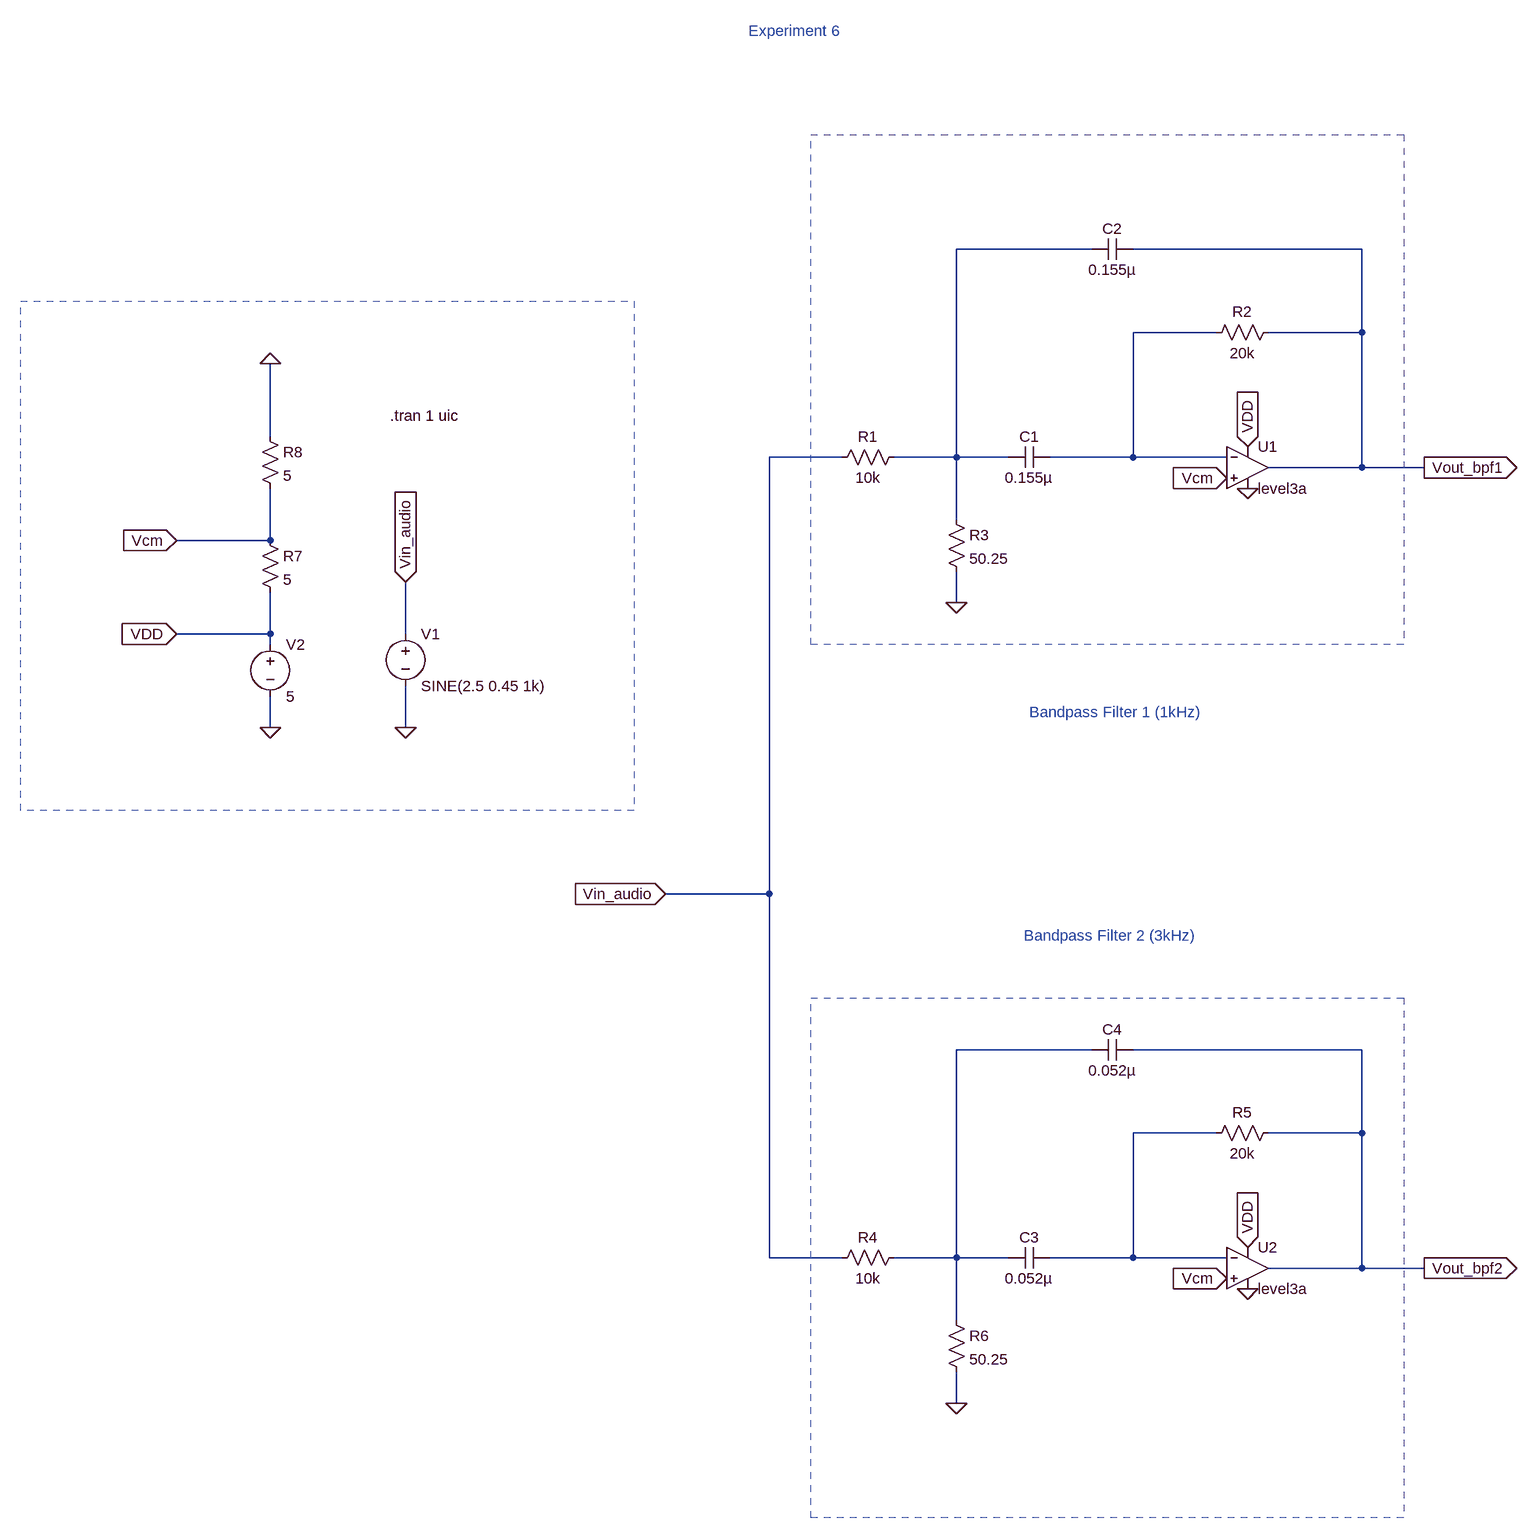
[diagram p0: schematic Ex 6.asc]
Ex 6.asc, the LTspice schematic file:
Version 4
SHEET 1 2004 1448
WIRE 720 -688 512 -688
WIRE 1136 -688 784 -688
WIRE 912 -560 784 -560
WIRE 1136 -560 1136 -688
WIRE 1136 -560 992 -560
WIRE -544 -400 -544 -512
WIRE 336 -368 224 -368
WIRE 512 -368 512 -688
WIRE 512 -368 416 -368
WIRE 592 -368 512 -368
WIRE 784 -368 784 -560
WIRE 784 -368 656 -368
WIRE 928 -368 784 -368
WIRE 1136 -352 1136 -560
WIRE 1136 -352 992 -352
WIRE 1232 -352 1136 -352
WIRE 512 -272 512 -368
WIRE -544 -240 -544 -320
WIRE -544 -240 -688 -240
WIRE 512 -144 512 -192
WIRE -544 -96 -544 -160
WIRE -544 -96 -688 -96
WIRE -336 -96 -336 -176
WIRE -544 -80 -544 -96
WIRE -544 48 -544 0
WIRE -336 48 -336 -16
WIRE 224 304 224 -368
WIRE 224 304 64 304
WIRE 720 544 512 544
WIRE 1136 544 784 544
WIRE 912 672 784 672
WIRE 1136 672 1136 544
WIRE 1136 672 992 672
WIRE 224 864 224 304
WIRE 336 864 224 864
WIRE 512 864 512 544
WIRE 512 864 416 864
WIRE 592 864 512 864
WIRE 784 864 784 672
WIRE 784 864 656 864
WIRE 928 864 784 864
WIRE 1136 880 1136 672
WIRE 1136 880 992 880
WIRE 1232 880 1136 880
WIRE 512 960 512 864
WIRE 512 1088 512 1040
FLAG 1232 -352 Vout_bpf1
IOPIN 1232 -352 Out
FLAG 512 -144 0
FLAG 1232 880 Vout_bpf2
IOPIN 1232 880 Out
FLAG 512 1088 0
FLAG 64 304 Vin_audio
IOPIN 64 304 In
FLAG -336 48 0
FLAG -336 -176 Vin_audio
IOPIN -336 -176 In
FLAG 960 -384 VDD
IOPIN 960 -384 In
FLAG 960 848 VDD
IOPIN 960 848 In
FLAG 960 -320 0
FLAG 960 912 0
FLAG 928 -336 Vcm
IOPIN 928 -336 In
FLAG 928 896 Vcm
IOPIN 928 896 In
FLAG -544 48 0
FLAG -544 -512 0
FLAG -688 -96 VDD
IOPIN -688 -96 In
FLAG -688 -240 Vcm
IOPIN -688 -240 In
SYMBOL res 432 -384 R90
WINDOW 0 0 56 VBottom 2
WINDOW 3 32 56 VTop 2
SYMATTR InstName R1
SYMATTR Value 10k
SYMBOL cap 656 -384 R90
WINDOW 0 0 32 VBottom 2
WINDOW 3 32 32 VTop 2
SYMATTR InstName C1
SYMATTR Value 0.155µ
SYMBOL res 1008 -576 R90
WINDOW 0 0 56 VBottom 2
WINDOW 3 32 56 VTop 2
SYMATTR InstName R2
SYMATTR Value 20k
SYMBOL res 496 -288 R0
SYMATTR InstName R3
SYMATTR Value 50.25
SYMBOL cap 784 -704 R90
WINDOW 0 0 32 VBottom 2
WINDOW 3 32 32 VTop 2
SYMATTR InstName C2
SYMATTR Value 0.155µ
SYMBOL res 432 848 R90
WINDOW 0 0 56 VBottom 2
WINDOW 3 32 56 VTop 2
SYMATTR InstName R4
SYMATTR Value 10k
SYMBOL cap 656 848 R90
WINDOW 0 0 32 VBottom 2
WINDOW 3 32 32 VTop 2
SYMATTR InstName C3
SYMATTR Value 0.052µ
SYMBOL res 1008 656 R90
WINDOW 0 0 56 VBottom 2
WINDOW 3 32 56 VTop 2
SYMATTR InstName R5
SYMATTR Value 20k
SYMBOL res 496 944 R0
SYMATTR InstName R6
SYMATTR Value 50.25
SYMBOL cap 784 528 R90
WINDOW 0 0 32 VBottom 2
WINDOW 3 32 32 VTop 2
SYMATTR InstName C4
SYMATTR Value 0.052µ
SYMBOL voltage -336 -112 R0
WINDOW 123 0 0 Left 0
WINDOW 39 0 0 Left 0
SYMATTR InstName V1
SYMATTR Value SINE(2.5 0.45 1k)
SYMBOL OpAmps\\UniversalOpAmp3 960 -352 R0
SYMATTR InstName U1
SYMBOL OpAmps\\UniversalOpAmp3 960 880 R0
SYMATTR InstName U2
SYMBOL voltage -544 -96 R0
WINDOW 123 0 0 Left 0
WINDOW 39 0 0 Left 0
SYMATTR InstName V2
SYMATTR Value 5
SYMBOL res -560 -256 R0
SYMATTR InstName R7
SYMATTR Value 5
SYMBOL res -560 -416 R0
SYMATTR InstName R8
SYMATTR Value 5
TEXT 624 24 Left 2 ;Bandpass Filter 1 (1kHz)
TEXT 616 368 Left 2 ;Bandpass Filter 2 (3kHz)
TEXT -360 -432 Left 2 !.tran 1 uic
TEXT 192 -1024 Left 2 ;Experiment 6
RECTANGLE Normal 1200 -80 288 -864 2
RECTANGLE Normal 1200 1264 288 464 2
RECTANGLE Normal 16 176 -928 -608 2

The netlist it stands for:
* Ex 6.asc
R1 N001 Vin_audio 10k
C1 N002 N001 0.155µ
R2 Vout_bpf1 N002 20k
R3 N001 0 50.25
C2 Vout_bpf1 N001 0.155µ
R4 N003 Vin_audio 10k
C3 N004 N003 0.052µ
R5 Vout_bpf2 N004 20k
R6 N003 0 50.25
C4 Vout_bpf2 N003 0.052µ
V1 Vin_audio 0 SINE(2.5 0.45 1k)
XU1 Vcm N002 VDD 0 Vout_bpf1 level3a  ; pins In+ In- V+ V- OUT
XU2 Vcm N004 VDD 0 Vout_bpf2 level3a  ; pins In+ In- V+ V- OUT
V2 VDD 0 5
R7 Vcm VDD 5
R8 0 Vcm 5
* Bandpass Filter 1 (1kHz)
* Bandpass Filter 2 (3kHz)
.tran 1 uic
* Experiment 6
.backanno
.end